# EAGLE design PRE_amp_22_5 (EAGLE 9.0.0)
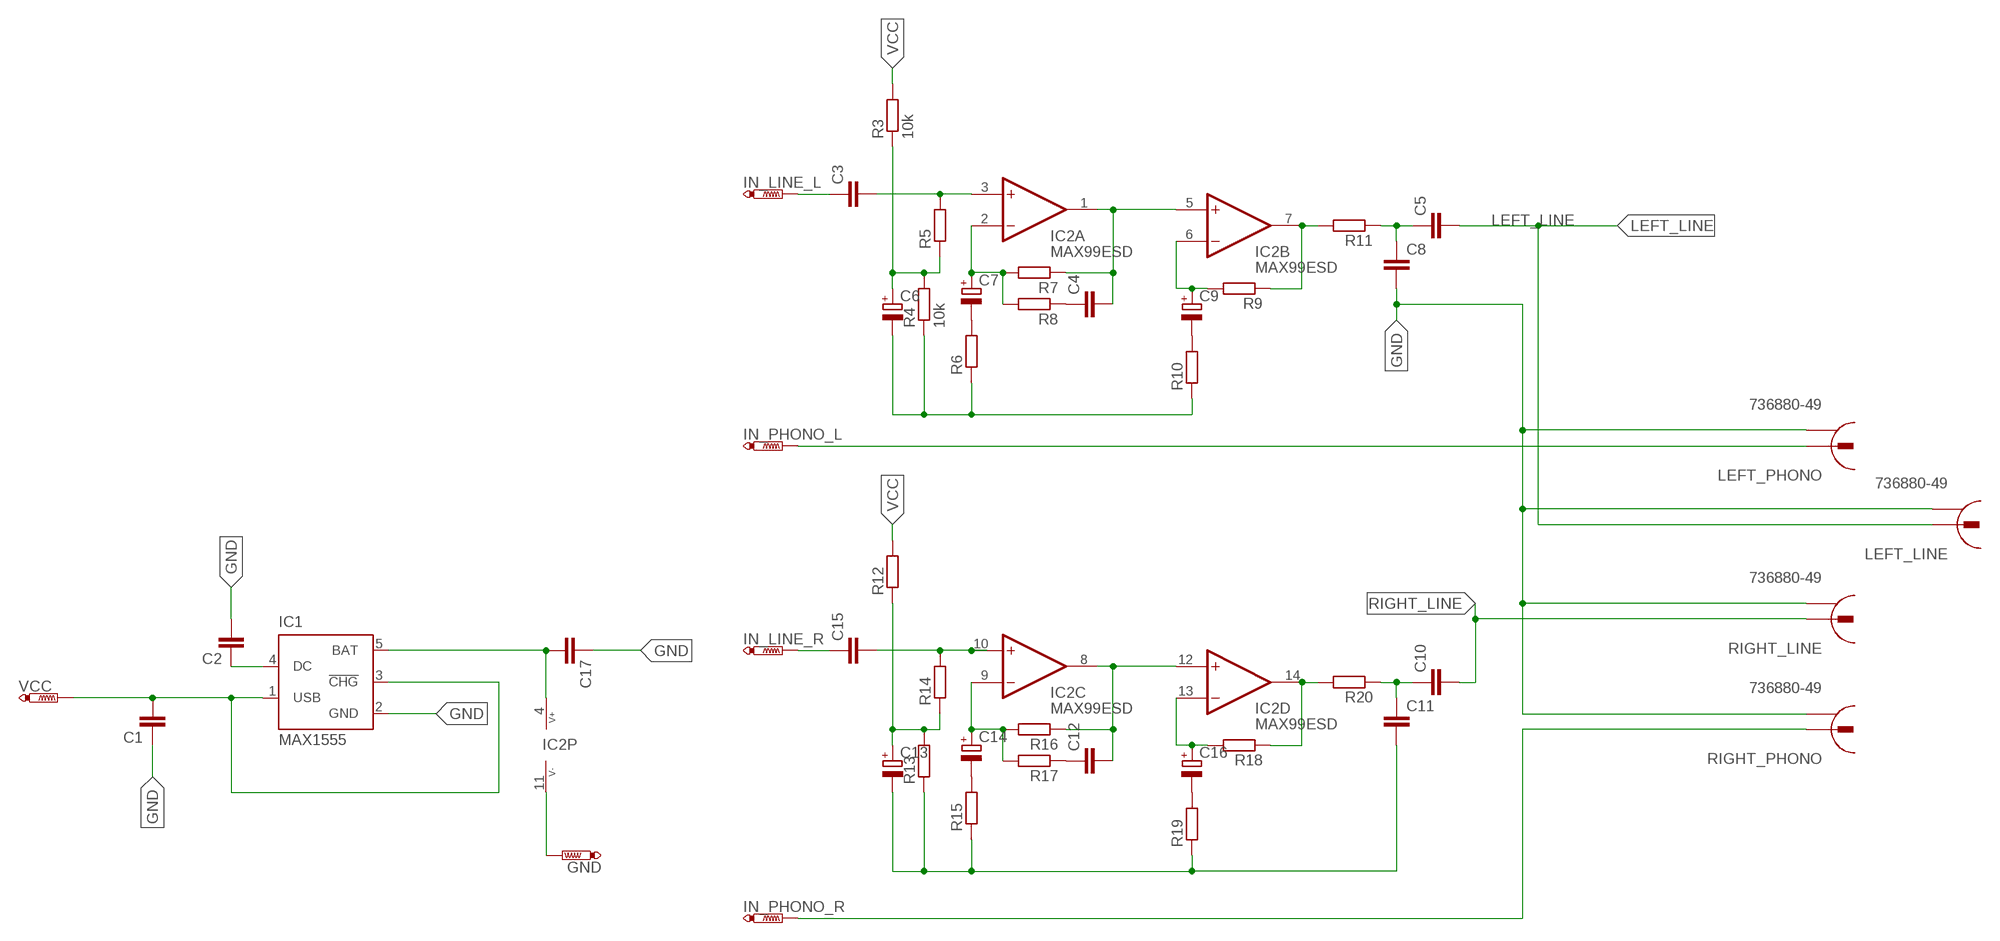
[diagram p0: schematic, sheet 1]

## Parts
C1  C-EUC0805  [C0805]
C2  C-EUC0805  [C0805]
C3  C-EUC0805  [C0805]
C4  C-EUC0805  [C0805]
C5  C-EUC0805  [C0805]
C6  CPOL-EUB45181B  [B45181B]
C7  CPOL-EUB45181B  [B45181B]
C8  C-EUC0805  [C0805]
C9  CPOL-EUB45181B  [B45181B]
C10  C-EUC0805  [C0805]
C11  C-EUC0805  [C0805]
C12  C-EUC0805  [C0805]
C13  CPOL-EUB45181B  [B45181B]
C14  CPOL-EUB45181B  [B45181B]
C15  C-EUC0805  [C0805]
C16  CPOL-EUB45181B  [B45181B]
C17  C-EUC0805  [C0805]
GND  PTR1PAD1-13Y  [P1-13Y]
IC1  MAX1555  [SOT23-5L]
IC2  MAX99ESD  [SO14]
IN_LINE_L  PTR1PAD1-13Y  [P1-13Y]
IN_LINE_R  PTR1PAD1-13Y  [P1-13Y]
IN_PHONO_L  PTR1PAD1-13Y  [P1-13Y]
IN_PHONO_R  PTR1PAD1-13Y  [P1-13Y]
LEFT_LINE  736880-49  [736880-49]
LEFT_PHONO  736880-49  [736880-49]
R3  10k  R-EU_R1206  [R1206]
R4  10k  R-EU_R1206  [R1206]
R5  R-EU_R1206  [R1206]
R6  R-EU_R1206  [R1206]
R7  R-EU_R1206  [R1206]
R8  R-EU_R1206  [R1206]
R9  R-EU_R1206  [R1206]
R10  R-EU_R1206  [R1206]
R11  R-EU_R1206  [R1206]
R12  R-EU_R1206  [R1206]
R13  R-EU_R1206  [R1206]
R14  R-EU_R1206  [R1206]
R15  R-EU_R1206  [R1206]
R16  R-EU_R1206  [R1206]
R17  R-EU_R1206  [R1206]
R18  R-EU_R1206  [R1206]
R19  R-EU_R1206  [R1206]
R20  R-EU_R1206  [R1206]
RIGHT_LINE  736880-49  [736880-49]
RIGHT_PHONO  736880-49  [736880-49]
VCC  PTR1PAD1-13Y  [P1-13Y]

## Nets
GND: C1.1 C2.2 C6.- C8.2 C11.2 C13.- C17.1 GND.1(TP) IC1.2(GND) IC2.11(P:V-) LEFT_LINE.2 LEFT_PHONO.2 R4.1 R6.1 R10.1 R13.1 R15.1 R19.1 RIGHT_LINE.2 RIGHT_PHONO.2
LEFT_LINE: C5.2 LEFT_LINE.1
N$1: C3.2 IC2.3(A:+IN) R5.2
N$2: C6.+ R3.1 R4.2 R5.1
N$3: C15.2 IC2.10(C:+IN) R14.2
N$4: C13.+ R12.1 R13.2 R14.1
N$5: IC2.7(B:OUT) R9.1 R11.2
N$6: C7.- R6.2
N$7: C4.1 R8.1
N$8: C12.1 R17.1
N$9: C7.+ IC2.2(A:-IN) R7.2 R8.2
N$10: C9.- R10.2
N$11: C5.1 C8.1 R11.1
N$12: C14.- R15.2
N$13: C9.+ IC2.6(B:-IN) R9.2
N$14: C1.2 IC1.1(USB) IC1.3(!CHG) VCC.1(TP)
N$15: C12.2 IC2.8(C:OUT) IC2.12(D:+IN) R16.1
N$16: C14.+ IC2.9(C:-IN) R16.2 R17.2
N$17: C16.- R19.2
N$18: IC2.14(D:OUT) R18.1 R20.2
N$19: C4.2 IC2.1(A:OUT) IC2.5(B:+IN) R7.1
N$20: C16.+ IC2.13(D:-IN) R18.2
N$21: C17.2 IC1.5(BAT) IC2.4(P:V+)
N$22: C2.1 IC1.4(DC)
N$23: IN_PHONO_R.1(TP) RIGHT_PHONO.1
N$25: C15.1 IN_LINE_R.1(TP)
N$26: C3.1 IN_LINE_L.1(TP)
N$27: IN_PHONO_L.1(TP) LEFT_PHONO.1
NS2: C10.1 C11.1 R20.1
RIGHT_LINE: C10.2 RIGHT_LINE.1
VCC: R3.2 R12.2
Unconnected: LEFT_LINE.2@2 LEFT_PHONO.2@2 RIGHT_LINE.2@2 RIGHT_PHONO.2@2

## Library data of the parts
C1-C5 C8 C10-C12 C15 C17 = rcl:C-EU: CAPACITOR, European symbol
C6 C7 C9 C13 C14 C16 = rcl:CPOL-EU: POLARIZED CAPACITOR, European symbol
GND IN_LINE_L IN_LINE_R IN_PHONO_L IN_PHONO_R VCC = testpad:PTR1: TEST PIN
IC1 = maxim:MAX1555: Dual-Input USB/AC Adapter 1-Cell Li+ Battery Chargers Source: http://www.maxim-ic.com .. MAX1551-MAX1555.pdf
IC2 = maxim:MAX99*: Micropower, Low-Voltage Rail-to-Rail I/O Comparators Source: http://pdfserv.maxim-ic.com/en/ds/MAX985-MAX994.pdf
LEFT_LINE LEFT_PHONO RIGHT_LINE RIGHT_PHONO = con-conrad:736880-49: Cinch Connector ( RCA Jack )
R3-R20 = rcl:R-EU_: RESISTOR, European symbol

## Board
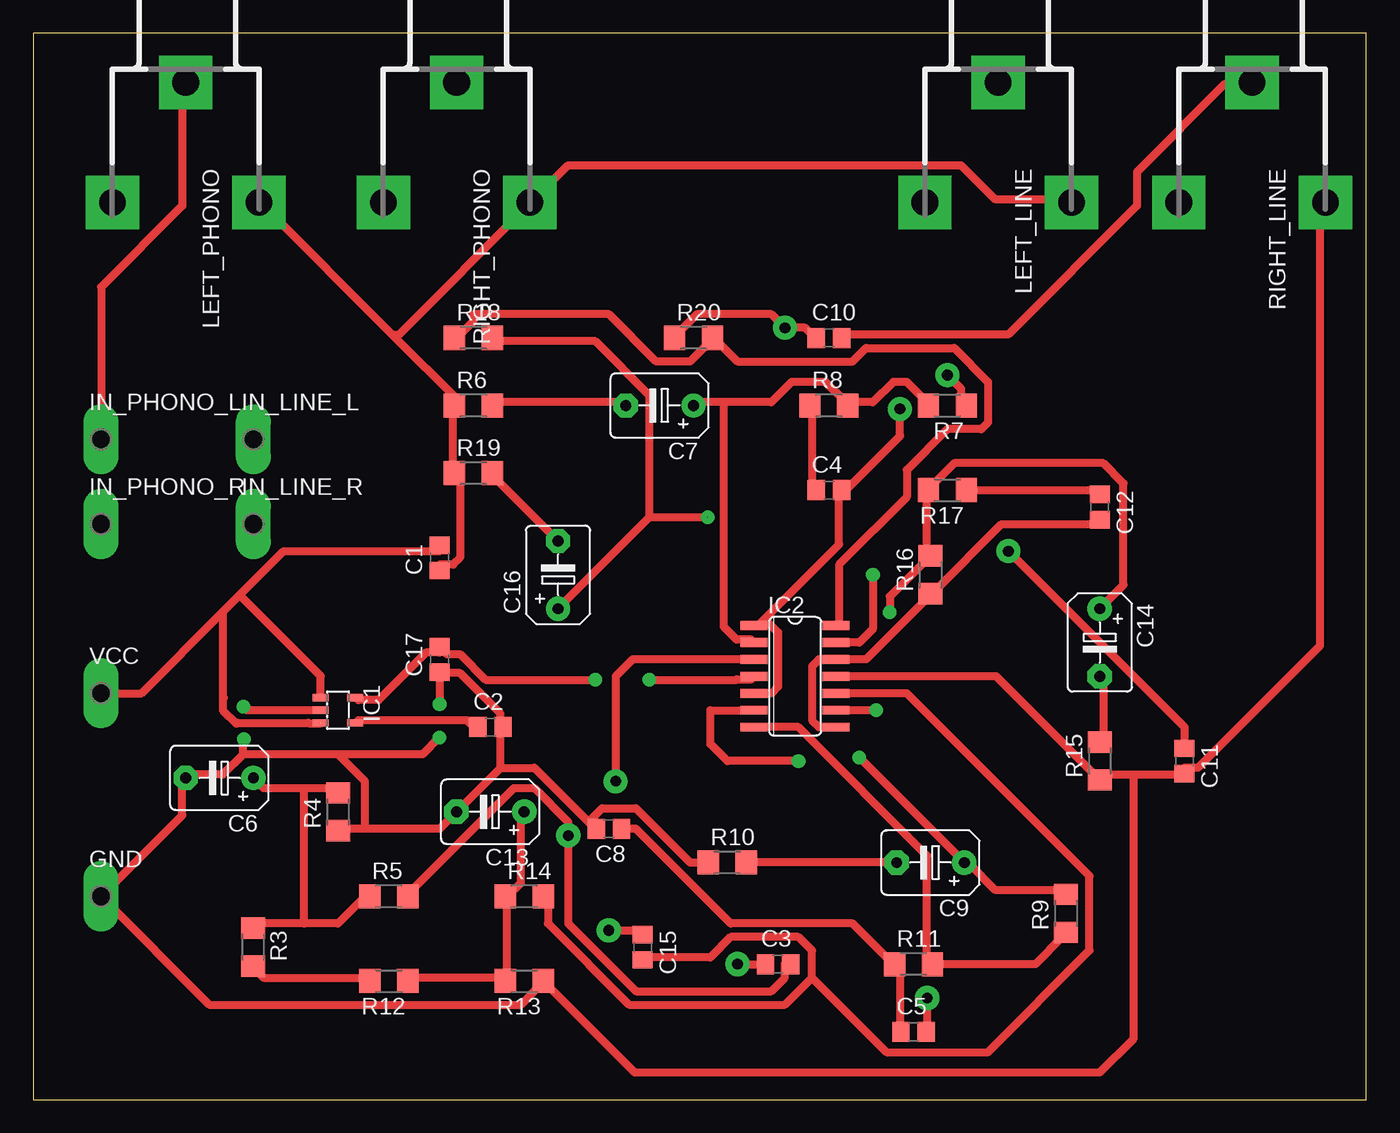
[diagram p1: board, top side]
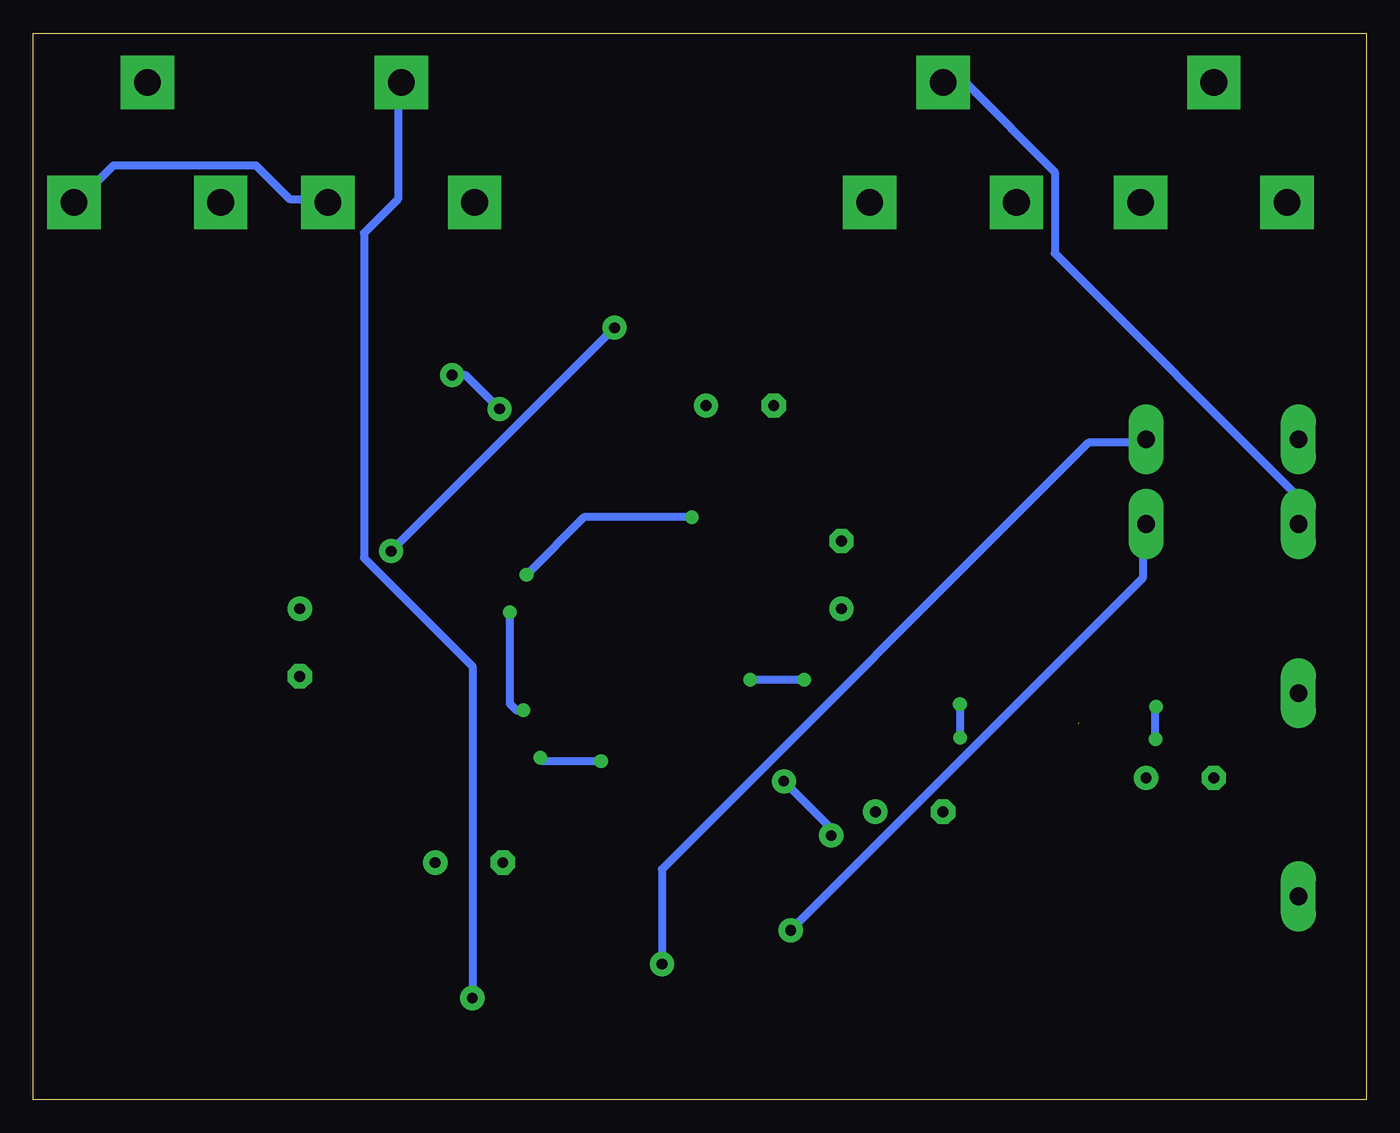
[diagram p2: board, bottom side, seen from below]

Size 100 x 80 mm. Coordinates in mm from the lower left corner, seen from the top.
Outline: 0,0 100,0 100,80 0,80 0,0
Copper layers (1*16): Top 0.035mm / dielectric 1.5mm / Bottom 0.035mm
Design rules "LabE": minimum track width 24mil, minimum drill 0.8mm, track to track 16mil, track to pad 16mil, pad to pad 16mil, via to via 16mil, smd to smd 16mil, copper to edge 0mil, drill to drill 16mil, minimum pad ring 20mil, minimum via ring 20mil, stop-mask expansion 4mil, vias tented up to drill 0mil, thermal gap 10mil

### Footprints (pad centres in the part's own frame; a part is rotated, then mirrored left to right if it is on the bottom)
C0805 = smd 1.3 x 1.5: 1 -0.95,0; 2 0.95,0
B45181B = drill 0.813: + -2.54,0 | drill 0.813 octagon: - 2.54,0
P1-13Y = drill 1.321 pad 1.905 long: 1 0,0
SOT23-5L = smd 0.55 x 1.2: 1 -0.95,-1.3; 2 0,-1.3; 3 0.95,-1.3; 4 0.95,1.3; 5 -0.95,1.3
SO14 = smd 0.66 x 2.032: 1 -3.81,-3.073; 2 -2.54,-3.073; 3 -1.27,-3.073; 4 0,-3.073; 5 1.27,-3.073; 6 2.54,-3.073; 7 3.81,-3.073; 8 3.81,3.073; 9 2.54,3.073; 10 1.27,3.073; 11 0,3.073; 12 -1.27,3.073; 13 -2.54,3.073; 14 -3.81,3.073
736880-49 = drill 2 pad 3.81 square: 1 -3.92,0; 2 5.08,5.5; 2@2 5.08,-5.5
R1206 = smd 1.6 x 1.803: 1 -1.422,0; 2 1.422,0

### Placement (x,y rotation side)
C1  30.48,40.64 90 top
C2  34.29,27.94 0 top
C3  55.88,10.16 0 top
C4  59.69,45.72 0 top
C5  66.04,5.08 0 top
C6  13.97,24.13 180 top
C7  46.99,52.07 180 top
C8  43.18,20.32 180 top
C9  67.31,17.78 180 top
C10  59.69,57.15 0 top
C11  86.36,25.4 270 top
C12  80.01,44.45 270 top
C13  34.29,21.59 180 top
C14  80.01,34.29 270 top
C15  45.72,11.43 270 top
C16  39.37,39.37 90 top
C17  30.48,33.02 90 top
GND  5.08,15.24 0 top
IC1  22.86,29.21 270 top
IC2  57.15,31.75 270 top
IN_LINE_L  16.51,49.53 0 top
IN_LINE_R  16.51,43.18 0 top
IN_PHONO_L  5.08,49.53 0 top
IN_PHONO_R  5.08,43.18 0 top
LEFT_LINE  72.39,72.39 270 top
LEFT_PHONO  11.43,72.39 270 top
R3  16.51,11.43 270 top
R4  22.86,21.59 90 top
R5  26.67,15.24 0 top
R6  33.02,52.07 0 top
R7  68.58,52.07 180 top
R8  59.69,52.07 0 top
R9  77.47,13.97 90 top
R10  52.07,17.78 0 top
R11  66.04,10.16 0 top
R12  26.67,8.89 180 top
R13  36.83,8.89 180 top
R14  36.83,15.24 0 top
R15  80.01,25.4 90 top
R16  67.31,39.37 90 top
R17  68.58,45.72 180 top
R18  33.02,57.15 0 top
R19  33.02,46.99 0 top
R20  49.53,57.15 0 top
RIGHT_LINE  91.44,72.39 270 top
RIGHT_PHONO  31.75,72.39 270 top
VCC  5.08,30.48 0 top

### Tracks (layer width: path | path; a pad name or v marks a point on that pad's centre or on a via)
GND  (via drill 0)
  Top 0.61: 82.55,24.38 80.26,24.38 R15.1 72.24,31.75 IC2.11 59.69,31.75 | 82.55,24.38 86.36,24.38 C11.2 86.36,24.89 87.38,24.89 96.52,34.04 96.52,67.06 RIGHT_LINE.2 | C1.1 30.48,40.13 31.5,40.13 32,40.64 32,46.74 R19.1 31.5,47.24 31.5,51.82 R6.1 32,52.32 26.92,57.4 | 35.05,24.89 35.05,27.94 | 35.05,24.89 C13.- 30.48,20.32 24.89,20.32 | 35.05,27.94 35.05,28.96 32,32 30.48,32 C17.1 v30.48,29.67 | 35.05,27.94 C2.2 | 41.66,20.83 37.59,24.89 35.05,24.89 | 41.66,20.83 42.16,20.32 C8.2 41.66,20.83 | R10.1 49.28,17.78 45.21,21.84 42.67,21.84 41.66,20.83 | 24.89,20.32 22.86,20.32 R4.1 | 26.92,57.4 17.27,67.06 LEFT_PHONO.2 | 26.92,57.4 27.43,57.4 37.08,67.06 RIGHT_PHONO.2 37.59,67.56 40.13,70.1 69.6,70.1 72.14,67.56 77.72,67.56 LEFT_LINE.2 | 15.75,25.91 14.22,24.38 11.68,24.38 C6.- 11.18,23.88 11.18,21.34 GND.1 13.21,7.11 36.58,7.11 38.1,8.64 R13.1 45.11,2.03 80.01,2.03 82.55,4.57 82.55,24.38 | 22.86,25.91 15.75,25.91 | 22.86,25.91 24.89,23.88 24.89,20.32 | v30.45,27.15 29.21,25.91 22.86,25.91 | 15.75,25.91 15.75,27.18 15.81,27.11 v15.81,27.04 | IC1.2 16.02,29.21 v15.75,29.48
  Bottom 0.61: LEFT_LINE.2 78.23,67.56 80.77,67.56 83.31,70.1 93.98,70.1 96.52,67.56 RIGHT_LINE.2 | v30.45,27.15 30.48,27.18 v30.48,29.67 | v15.81,27.04 15.81,29.15 15.75,29.21 v15.75,29.48
LEFT_LINE  (via drill 0.8)
  Top 0.61: v67.06,7.62 67.06,5.08 C5.2
  Bottom 0.61: v67.06,7.62 67.06,32.51 75.18,40.64 75.18,65.02 72.64,67.56 72.64,76.2 LEFT_LINE.1
N$1  (via drill 0.8)
  Top 0.61: C3.2 56.39,10.16 56.39,9.14 55.37,8.13 45.21,8.13 40.13,13.21 v40.13,19.81 40.13,20.83 37.59,23.37 36.07,23.37 27.94,15.24 R5.2 | IC2.3 44.96,33.02 43.69,31.75 v43.69,23.88
  Bottom 0.61: v43.69,23.88 40.13,20.32 v40.13,19.81
N$2
  Top 0.61: 20.32,23.37 17.27,23.37 C6.+ | 20.32,23.37 22.86,23.37 R4.2 | 20.32,13.21 22.86,13.21 24.89,15.24 R5.1 | 20.32,13.21 16.76,13.21 R3.1 | 20.32,13.21 20.32,23.37
N$3
  Top 0.61: 58.42,9.14 58.42,11.18 57.4,12.19 52.32,12.19 50.8,10.67 45.72,10.67 C15.2 | 58.42,9.14 56.39,7.11 44.7,7.11 38.61,13.21 38.61,15.24 R14.2 | IC2.10 65.53,30.48 79.25,16.76 79.25,11.18 71.63,3.56 64.01,3.56 58.42,9.14
N$4
  Top 0.61: R12.1 28.45,9.14 35.05,9.14 R13.2 35.56,9.14 35.56,15.24 | 35.56,15.24 36.58,16.26 36.58,21.34 C13.+ | 35.56,15.24 R14.1
N$5
  Top 0.61: R9.1 77.22,12.19 75.18,10.16 R11.2 67.06,10.16 67.06,18.29 57.4,27.94 IC2.7
N$6
  Top 0.61: R6.2 34.54,52.32 44.2,52.32 C7.-
N$7
  Top 0.61: C4.1 58.42,45.72 58.42,51.82 R8.1
N$8
  Top 0.61: R17.1 79.76,45.72 C12.1
N$9
  Top 0.61: R7.2 67.06,52.32 65.53,53.85 64.52,53.85 62.99,52.32 61.47,52.32 R8.2 60.96,52.32 59.44,53.85 56.9,53.85 55.37,52.32 51.82,52.32 | 51.82,52.32 49.78,52.32 C7.+ | IC2.2 53.85,34.52 52.77,34.52 51.82,35.47 51.82,52.32
N$10
  Top 0.61: C9.- R10.2
N$11
  Top 0.61: C5.1 65.02,5.08 65.02,10.16 R11.1 64.52,10.16 61.47,13.21 52.32,13.21 45.21,20.32 C8.1
N$12
  Top 0.61: R15.2 80.26,26.92 80.26,31.5 C14.-
N$13  (via drill 0)
  Top 0.61: R9.2 77.22,15.75 72.14,15.75 70.1,17.78 C9.+ v61.98,25.65 | v57.4,25.4 52.07,25.4 50.8,26.67 50.8,29.21 IC2.6
  Bottom 0.61: v61.98,25.65 61.72,25.4 v57.4,25.4
N$14  (1 unrouted)
  Top 0.61: 14.22,36.58 8.13,30.48 VCC.1 | 14.22,36.58 15.49,37.85 | 15.49,37.85 18.8,41.15 30.48,41.15 C1.2 | 14.22,36.58 14.22,30.23 | 14.22,30.23 14.22,29.21 15.24,28.19 15.31,28.26 20.63,28.26 20.66,28.22 21.56,28.22 | 14.29,30.16 14.22,30.23 | IC1.1 21.56,31.78 15.49,37.85
N$15
  Top 0.61: IC2.8 58.93,27.94 58.42,28.45 58.42,32.51 58.93,33.02 IC2.12 62.48,33.02 67.06,37.59 R16.1 67.56,38.1 72.64,43.18 79.76,43.18 C12.2
N$16  (via drill 0)
  Top 0.61: C14.+ 81.79,38.61 81.79,46.23 80.26,47.75 69.09,47.75 67.56,46.23 67.56,45.72 R17.2 67.06,45.72 67.06,41.15 R16.2 64.26,37.74 v64.26,36.58 | v63.25,29.21 IC2.9
  Bottom 0.61: v64.26,36.58 64.26,29.72 63.75,29.21 v63.25,29.21
N$17
  Top 0.61: C16.- 34.54,46.74 R19.2
N$18
  Top 0.61: R18.1 32,57.4 33.02,58.42 33.02,58.93 43.18,58.93 46.74,55.37 49.28,55.37 50.8,56.9 R20.2 51.31,56.9 52.83,55.37 61.47,55.37 62.48,56.39 69.09,56.39 71.63,53.85 71.63,50.8 71.12,50.29 68.58,50.29 65.53,47.24 65.53,45.21 60.45,40.13 60.45,35.56 IC2.14
N$19  (via drill 0.8)
  Top 0.61: 54.86,36.07 54.36,35.56 IC2.1 | 54.86,36.07 60.45,41.66 60.45,45.72 C4.2 60.96,45.72 65.02,49.78 v65.02,51.82 | v68.58,54.36 69.6,53.34 69.6,52.32 R7.1 | IC2.5 55.37,30.48 55.88,30.99 55.88,35.05 54.86,36.07
  Bottom 0.61: v68.58,54.36 67.56,54.36 v65.02,51.82
N$20  (via drill 0)
  Top 0.61: 46.23,43.69 46.23,52.83 42.16,56.9 34.54,56.9 R18.2 | C16.+ 46.23,43.69 | 46.23,43.69 v50.6,43.69 50.8,43.69 | v62.99,39.37 62.99,35.31 61.98,34.29 IC2.13
  Bottom 0.61: v50.6,43.69 58.67,43.69 v62.99,39.37
N$21  (via drill 0)
  Top 0.61: IC1.5 24.38,29.97 25.91,29.97 29.46,33.53 30.48,33.53 C17.2 31.02,33.43 32.01,33.43 33.95,31.5 v42.16,31.5 | v46.23,31.5 52.74,31.5 52.77,31.52 53.85,31.52 IC2.4
  Bottom 0.61: v42.16,31.5 v46.23,31.5
N$22
  Top 0.61: IC1.4 24.38,28.45 32.51,28.45 33.02,27.94 C2.1
N$23
  Bottom 0.61: IN_PHONO_R.1 5.08,45.21 23.37,63.5 23.37,69.6 29.97,76.2 31.5,76.2 RIGHT_PHONO.1
N$25  (via drill 0.8)
  Top 0.61: v43.18,12.7 45.72,12.7 C15.1
  Bottom 0.61: v43.18,12.7 16.76,39.12 16.76,43.18 IN_LINE_R.1
N$26  (via drill 0.8)
  Top 0.61: v52.83,10.16 C3.1
  Bottom 0.61: v52.83,10.16 52.83,17.27 20.83,49.28 16.76,49.28 IN_LINE_L.1
N$27
  Top 0.61: IN_PHONO_L.1 5.08,60.96 11.18,67.06 11.18,76.2 LEFT_PHONO.1
NS2  (via drill 0.8)
  Top 0.61: C11.1 86.36,27.94 v73.15,41.15 | C10.1 58.42,57.4 57.91,57.91 v56.39,57.91 55.37,58.93 49.78,58.93 48.26,57.4 R20.1
  Bottom 0.61: v56.39,57.91 v73.15,41.15
RIGHT_LINE
  Top 0.61: C10.2 60.96,57.4 73.15,57.4 82.8,67.06 82.8,69.6 89.41,76.2 91.44,76.2 RIGHT_LINE.1
VCC
  Top 0.61: R12.2 24.89,9.14 17.27,9.14 16.76,9.65 R3.2